# EAGLE design surficial_tilt_v2_1.2 (EAGLE 9.6.2)
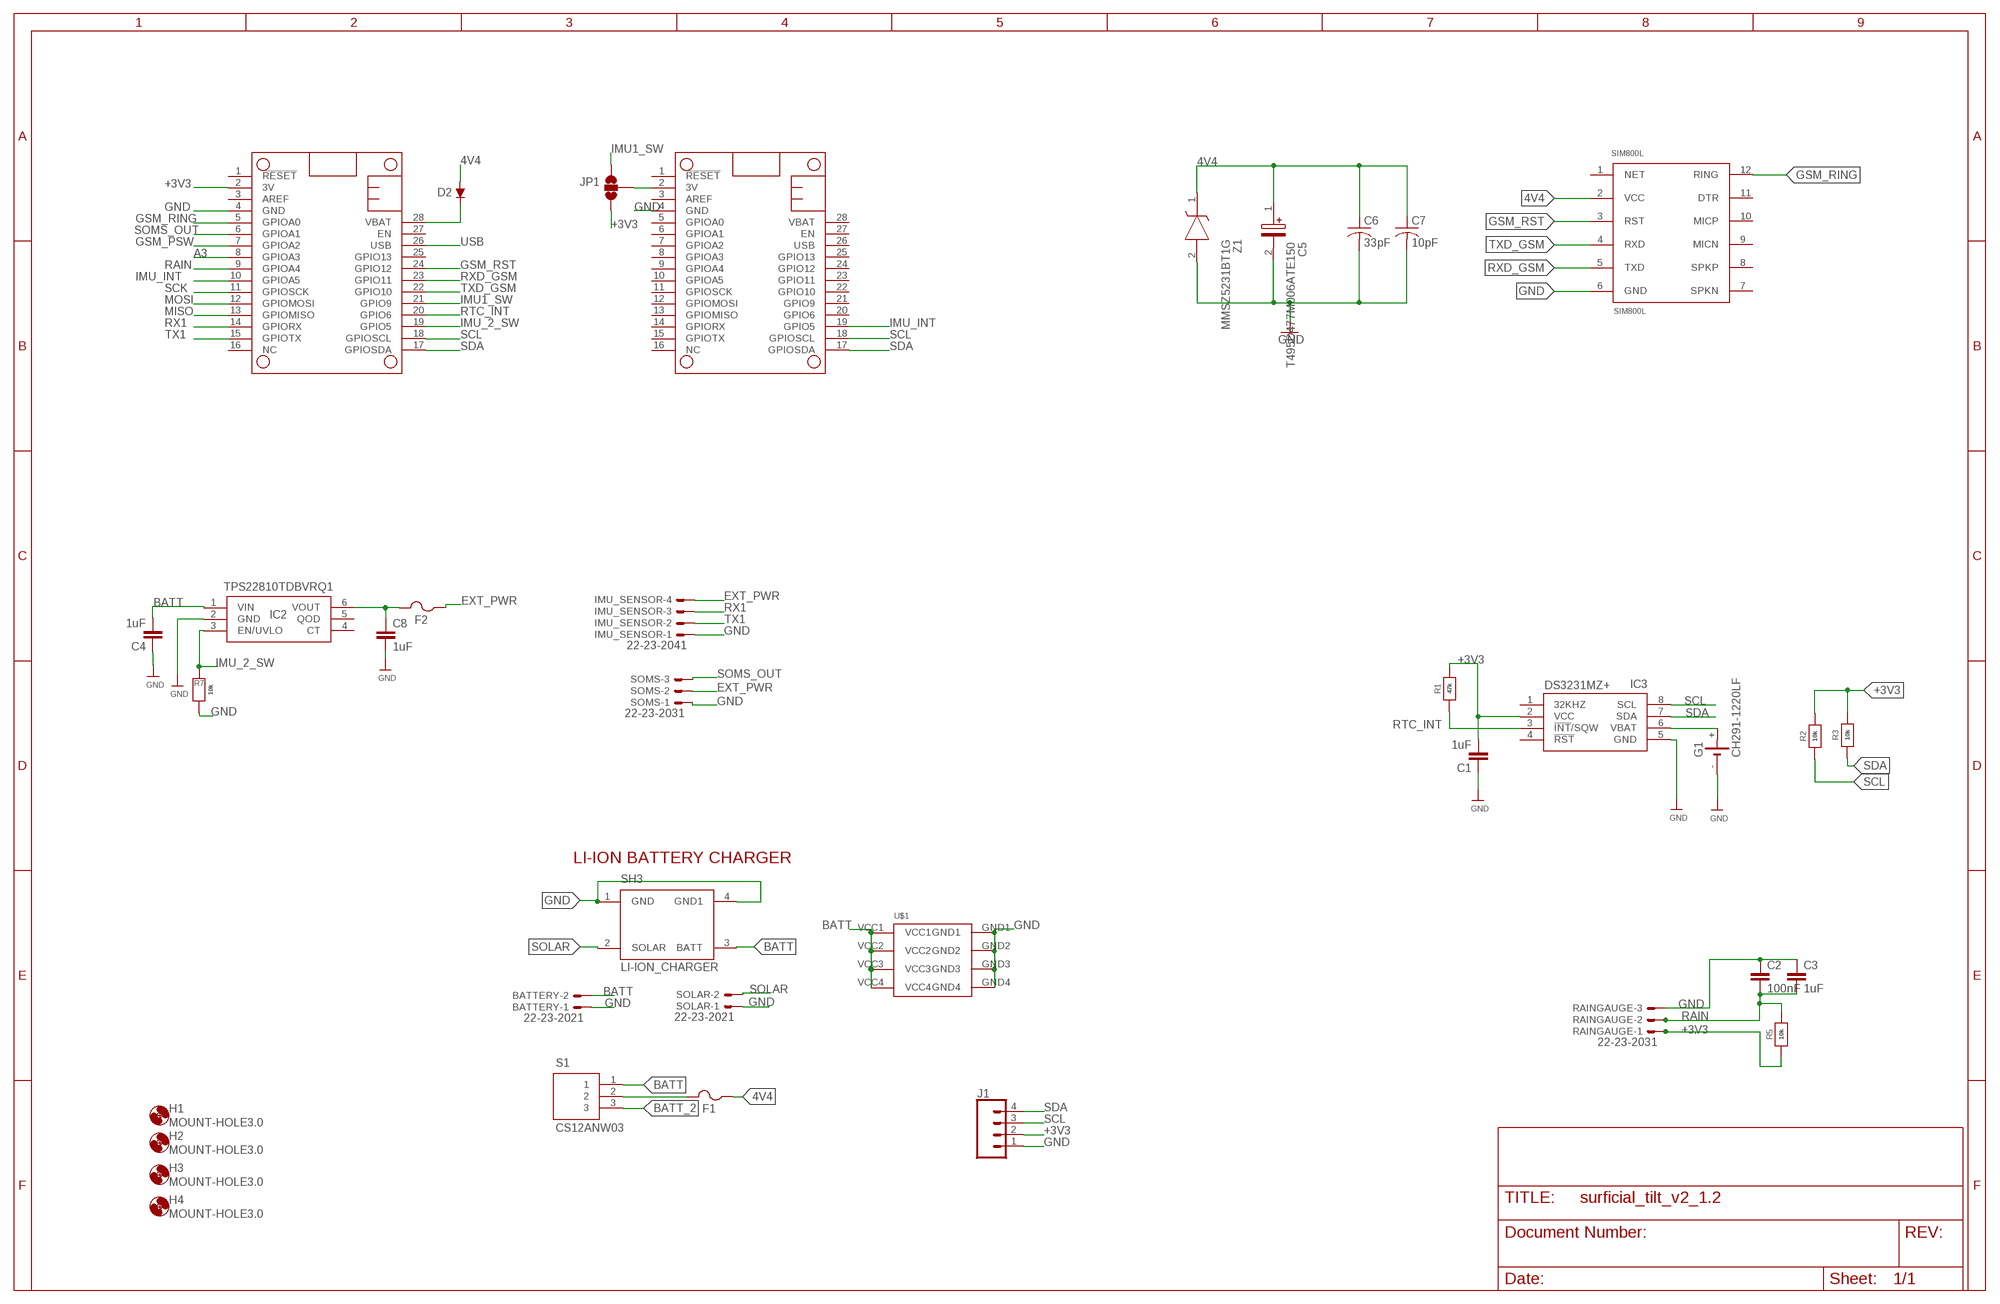
[diagram p0: schematic, sheet 1]

## Parts
BATTERY  22-23-2021  [22-23-2021]
C1  1uF  CC0603  [C0603]
C2  100nF  CC0603  [C0603]
C3  1uF  CC0603  [C0603]
C4  1uF  CC0603  [C0603]
C5  T495D477M006ATE150  [CAPPM7343X310N]
C6  33pF  C-USC0603  [C0603]
C7  10pF  C-USC0603  [C0603]
C8  1uF  CC0603  [C0603]
D2  DIODE_DIODE-SOD123  [DIODE_SOD123]
F1  PTCFUSE-1206  [R1206]
F2  PTCFUSE-1206  [R1206]
G1  CH291-1220LF  [CH291-1220LF]
H1  MOUNT-HOLE3.0  [3,0]
H2  MOUNT-HOLE3.0  [3,0]
H3  MOUNT-HOLE3.0  [3,0]
H4  MOUNT-HOLE3.0  [3,0]
IC2  TPS22810TDBVRQ1  [SOT95P280X145-6N]
IC3  DS3231MZ+  [SOIC127P600X175-8N]
IMU_SENSOR  22-23-2041  [22-23-2041]
J1  CONN_04PTH  [1X04]
JP1  JUMPER-SMT_3_NO_SILK  [SMT-JUMPER_3_NO_SILK]
MS2  FEATHERWING_NODIM  [FEATHERWING_DIM]
MS3  FEATHERWING_NODIM  [FEATHERWING_DIM]
R1  47k  RESISTOR_0603_NOOUT  [0603-NO]
R2  10k  RESISTOR_0603_NOOUT  [0603-NO]
R3  10k  RESISTOR_0603_NOOUT  [0603-NO]
R5  10k  RESISTOR_0603_NOOUT  [0603-NO]
R7  10k  RESISTOR_0603_NOOUT  [0603-NO]
RAINGAUGE  22-23-2031  [22-23-2031]
S1  CS12ANW03  [CS12ANW03]
SH3  LI-ION_CHARGER  [LI-ION_CHARGER]
SIM800L  SIM800L  [GSM_SIM800L]
SOLAR  22-23-2021  [22-23-2021]
SOMS  22-23-2031  [22-23-2031]
U$1  18650_HOLDER4_BATT_18650_BOTTOM  [4_BATT_18650_BOTTOM]
Z1  MMSZ5231BT1G  [SOD3716X135N]

## Nets
3V: JP1.2 MS3.2(3V)
4V4: C5.1(+) C6.1 C7.1 D2.A F1.1 SIM800L.2(VCC) Z1.1(K)
+3V3: C1.2 IC3.2(VCC) J1.2 JP1.1 MS2.2(3V) R1.2 R2.2 R3.2 R5.1 RAINGAUGE.1
A3: MS2.8(GPIOA3)
BATT: BATTERY.2 C4.2 IC2.1(VIN) S1.1 SH3.3(BATT) U$1.VCC1 U$1.VCC2 U$1.VCC3 U$1.VCC4
BATT_2: S1.3
EXT_PWR: F2.1 IMU_SENSOR.4 SOMS.2
GND: BATTERY.1 C1.1 C2.1 C3.1 C4.1 C5.2(-) C6.2 C7.2 C8.2 G1.- IC2.2(GND) IC3.5(GND) IMU_SENSOR.1 J1.1 MS2.4(GND) MS3.4(GND) R7.1 RAINGAUGE.3 SH3.1(GND) SH3.4(GND1) SIM800L.6(GND) SOLAR.1 SOMS.1 U$1.GND1 U$1.GND2 U$1.GND3 U$1.GND4 Z1.2(A)
GSM_PSW: MS2.7(GPIOA2)
GSM_RING: MS2.5(GPIOA0) SIM800L.12(RING)
GSM_RST: MS2.24(GPIO12) SIM800L.3(RST)
IMU1_SW: JP1.3 MS2.21(GPIO9)
IMU_2_SW: IC2.3(EN/UVLO) MS2.19(GPIO5) R7.2
IMU_INT: MS2.10(GPIOA5) MS3.19(GPIO5)
MISO: MS2.13(GPIOMISO)
MOSI: MS2.12(GPIOMOSI)
N$1: C8.1 F2.2 IC2.6(VOUT)
N$2: G1.+ IC3.6(VBAT)
N$16: F1.2 S1.2
RAIN: C2.2 C3.2 MS2.9(GPIOA4) R5.2 RAINGAUGE.2
RTC_INT: IC3.3(!INT!/SQW) MS2.20(GPIO6) R1.1
RX1: IMU_SENSOR.3 MS2.14(GPIORX)
RXD_GSM: MS2.23(GPIO11) SIM800L.5(TXD)
SCK: MS2.11(GPIOSCK)
SCL: IC3.8(SCL) J1.3 MS2.18(GPIOSCL) MS3.18(GPIOSCL) R2.1
SDA: IC3.7(SDA) J1.4 MS2.17(GPIOSDA) MS3.17(GPIOSDA) R3.1
SOLAR: SH3.2(SOLAR) SOLAR.2
SOMS_OUT: MS2.6(GPIOA1) SOMS.3
TX1: IMU_SENSOR.2 MS2.15(GPIOTX)
TXD_GSM: MS2.22(GPIO10) SIM800L.4(RXD)
USB: MS2.26(USB)
VBAT: D2.C MS2.28(VBAT)
Unconnected: IC2.4(CT) IC2.5(QOD) IC3.1(32KHZ) IC3.4(!RST) MS2.1(!RESET) MS2.3(AREF) MS2.16(NC) MS2.25(GPIO13) MS2.27(EN) MS3.1(!RESET) MS3.3(AREF) MS3.5(GPIOA0) MS3.6(GPIOA1) MS3.7(GPIOA2) MS3.8(GPIOA3) MS3.9(GPIOA4) MS3.10(GPIOA5) MS3.11(GPIOSCK) MS3.12(GPIOMOSI) MS3.13(GPIOMISO) MS3.14(GPIORX) MS3.15(GPIOTX) MS3.16(NC) MS3.20(GPIO6) MS3.21(GPIO9) MS3.22(GPIO10) MS3.23(GPIO11) MS3.24(GPIO12) MS3.25(GPIO13) MS3.26(USB) MS3.27(EN) MS3.28(VBAT) SIM800L.1(NET) SIM800L.7(SPKN) SIM800L.8(SPKP) SIM800L.9(MICN) SIM800L.10(MICP) SIM800L.11(DTR)

## Notes on the sheet
- LI-ION BATTERY CHARGER

## Library data of the parts
BATTERY SOLAR = con-molex:22-23-2021: .100" (2.54mm) Center Header - 2 Pin; MF: MOLEX; MPN: 22-23-2021; OC_FARNELL: 1462926; OC_NEWARK: 25C3832
C1-C4 C8 = eagle-ltspice:C: CAPACITOR, European symbol; SPICEMODEL: NONE; SPICEPREFIX: C
C5 = SamacSys_Parts:T495D477M006ATE150: Tantalum Capacitors - Solid SMD 6.3volts 470uF 20% Source: Datasheet <https://componentsearchengine.com/Datasheets/1/T495D477M006ATE150.pdf>; DESCRIPTION: Tantalum Capacitors - Solid SMD 6.3volts 470uF 20%; HEIGHT: 3.1mm; MANUFACTURER_NAME: Kemet; MANUFACTURER_PART_NUMBER: T495D477M006ATE150; MOUSER_PART_NUMBER: 80-T495D477M6ATE150; MOUSER_PRICE-STOCK: https://www.mouser.com/Search/Refine.aspx?Keyword=80-T495D477M6ATE150
C6 C7 = rcl:C-US: CAPACITOR, American symbol; SPICEPREFIX: C
D2 = 52101-101-REV-A_v16:DIODE_DIODE-: DIODE
F1 F2 = adafruit:PTCFUSE: PTC fuses, resettable thermistors
G1 = battery:CH291-1220LF: Battery Holder, SMT, 12mm multicomp PART NO. CH291-1220LF Source: Data sheet <http://www.farnell.com/datasheets/1505860.pdf>
H1-H4 = holes:MOUNT-HOLE: MOUNTING HOLE with drill center marker
IC2 = TPS22810TDBVRQ1:TPS22810TDBVRQ1: Automotive 18V, 2A, 79m Load Switch With Adjustable Rise Time and Adjustable Quick Output Discharge Source: Datasheet <http://www.ti.com/lit/gpn/tps22810-q1>; DESCRIPTION: Automotive 18V, 2A, 79m Load Switch With Adjustable Rise Time and Adjustable Quick Output Discharge; HEIGHT: 1.45mm; MANUFACTURER_NAME: Texas Instruments; MANUFACTURER_PART_NUMBER: TPS22810TDBVRQ1
IC3 = DS3231MZ+:DS3231MZ+: Real Time Clock 5+/-ppm RTC Source: Datasheet <http://uk.rs-online.com/web/p/products/1897249>; DESCRIPTION: Real Time Clock 5+/-ppm RTC; HEIGHT: 1.75mm; MANUFACTURER_NAME: Maxim Integrated; MANUFACTURER_PART_NUMBER: DS3231MZ+; RS_PART_NUMBER: 1897249; RS_PRICE-STOCK: http://uk.rs-online.com/web/p/products/1897249
IMU_SENSOR = con-molex:22-23-2041: .100" (2.54mm) Center Header - 4 Pin; MF: MOLEX; MPN: 22-23-2041; OC_FARNELL: 1462920; OC_NEWARK: 38C0355
J1 = SparkFun-Connectors:CONN_04: Multi connection point. Often used as Generic Header-pin footprint for 0.1 inch spaced/style header connections On any of the 0.1 inch spaced packages, you can populate with these: Break Away Headers - Straight <https://www.sparkfun.com/products/116> (PRT-00116) Break Away Male Headers - Right Angle <https://www.sparkfun.com/products/553> (PRT-00553) Female Headers <https://www.sparkfun.com/products/115> (PRT-00115) Break Away Headers - Machine Pin <https://www.sparkfun.com/products/117> (PRT-00117) Break Away Female Headers - Swiss Machine Pin <https://www.sparkfun.com/products/743> (PRT-00743) For SCREWTERMINALS and SPRING TERMINALS visit here: Screw Terimnals on SparkFun.com <https://www.sparkfun.com/search/results?term=Screw+Terminals> (5mm/3.5mm/2.54mm spacing) This device is also useful as a general connection point to wire up your design to another part of your project. Our various solder wires solder well into these plated through hole pads. Hook-Up Wire - Assortment (Stranded, 22 AWG) <https://www.sparkfun.com/products/11375> (PRT-11375) Hook-Up Wire - Assortment (Solid Core, 22 AWG) <https://www.sparkfun.com/products/11367> (PRT-11367) View the entire wire category on our website here <https://www.sparkfun.com/categories/141> Special notes: Molex polarized connector foot print use with SKU : PRT-08231 with associated crimp pins and housings. 1MM SMD Version SKU: PRT-10208; PROD_ID: CONN-09696
JP1 = SparkFun-Jumpers:JUMPER-SMT_3_NO: Normally open jumper This jumper has three pads in close proximity to each other. Apply solder to close the connection(s).
MS2 MS3 = adafruit:FEATHERWING
R1-R3 R5 R7 = microbuilder:RESISTOR: Resistors For new designs, use the packages preceded by an '_' character since they are more reliable: The following footprints should be used on most boards: _0402 - Standard footprint for regular board layouts _0603 - Standard footprint for regular board layouts _0805 - Standard footprint for regular board layouts _1206 - Standard footprint for regular board layouts For extremely tight-pitch boards where space is at a premium, the following 'micro-pitch' footprints can be used (smaller pads, no silkscreen outline, etc.): _0402MP - Micro-pitch footprint for very dense/compact boards _0603MP - Micro-pitch footprint for very dense/compact boards _0805MP - Micro-pitch footprint for very dense/compact boards _1206MP - Micro-pitch footprint for very dense/compact boards
RAINGAUGE SOMS = con-molex:22-23-2031: .100" (2.54mm) Center Header - 3 Pin; MF: MOLEX; MPN: 22-23-2031; OC_FARNELL: 1462950; OC_NEWARK: 30C0862
S1 = SamacSys_Parts:CS12ANW03: NKK SWITCHES - CS12ANW03 - SWITCH, SLIDE, SPDT, 3A, 250V, TH Source: Datasheet <http://www.nkkswitches.com/pdf/cs.pdf>; ARROW_PART_NUMBER: CS12ANW03; ARROW_PRICE-STOCK: https://www.arrow.com/en/products/cs12anw03/nkk-switches; DESCRIPTION: NKK SWITCHES - CS12ANW03 - SWITCH, SLIDE, SPDT, 3A, 250V, TH; HEIGHT: mm; MANUFACTURER_NAME: NKK Switches; MANUFACTURER_PART_NUMBER: CS12ANW03; MOUSER_PART_NUMBER: 633-CS12ANW03; MOUSER_PRICE-STOCK: https://www.mouser.co.uk/ProductDetail/NKK-Switches/CS12ANW03?qs=4P1McwaGddbVHu%252BBZT0egw%3D%3D
SH3 = Li-Ion_chargers:LI-ION_CHARGER
SIM800L = gsm_shield:SIM800L
U$1 = 18650_holder_4:18650_HOLDER
Z1 = SamacSys_Parts:MMSZ5231BT1G: 5.1V Zener diode,MMSZ5231B 500mW ON Semiconductor MMSZ5231BT1G Zener Diode, 5.1V 5% 0.5 W SMT 2-Pin SOD-123 Source: Datasheet <http://uk.rs-online.com/web/p/products/5453049P>; ALLIED_NUMBER: 70099546; DESCRIPTION: 5.1V Zener diode,MMSZ5231B 500mW ON Semiconductor MMSZ5231BT1G Zener Diode, 5.1V 5% 0.5 W SMT 2-Pin SOD-123; HEIGHT: 1.35mm; MANUFACTURER_NAME: ON Semiconductor; MANUFACTURER_PART_NUMBER: MMSZ5231BT1G; RS_PART_NUMBER: 5453049P

## Board
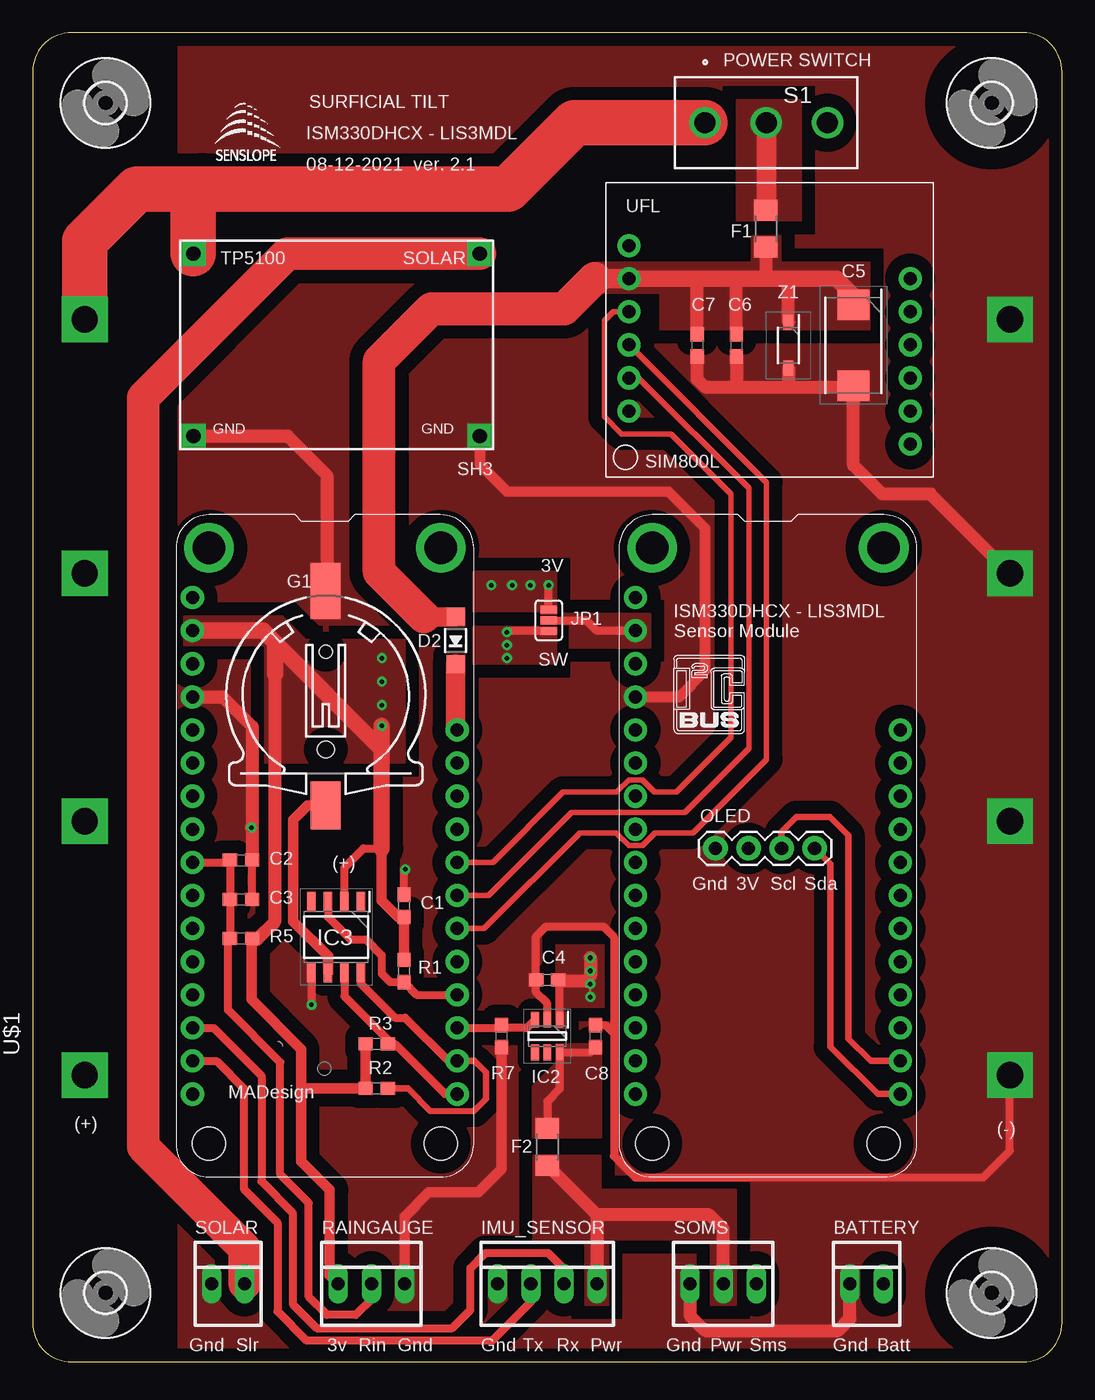
[diagram p1: board, top side]
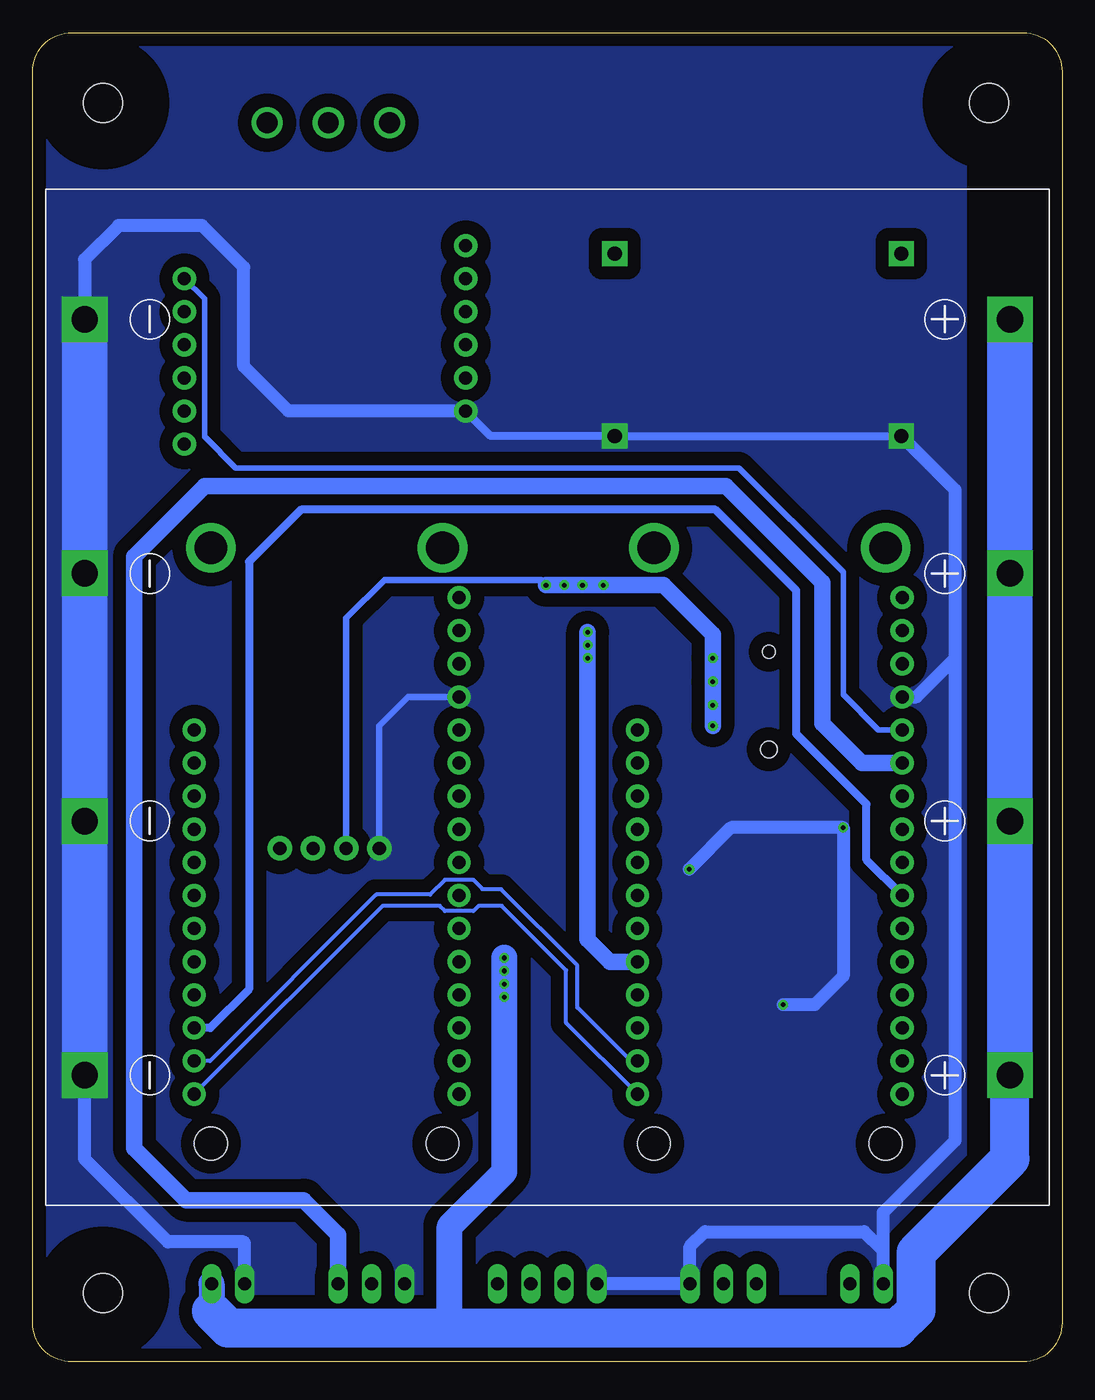
[diagram p2: board, bottom side, seen from below]

Size 79 x 102 mm. Coordinates in mm from the lower left corner, seen from the top.
Outline: 76,102 3,102 arc90 0,99 0,3 arc90 3,0 76,0 arc90 79,3 79,99 arc90 76,102
Copper layers (1*16): Top 0.035mm / dielectric 1.5mm / Bottom 0.035mm
Design rules "default": minimum track width 6mil, minimum drill 0.35mm, track to track 6mil, track to pad 6mil, pad to pad 6mil, via to via 6mil, smd to smd 6mil, copper to edge 40mil, drill to drill 6mil, minimum pad ring 10mil, minimum via ring 8mil, stop-mask expansion 4mil, vias tented up to drill 0mil, thermal gap 10mil

### Footprints (pad centres in the part's own frame; a part is rotated, then mirrored left to right if it is on the bottom)
22-23-2021 = drill 1 long: 1 -1.27,0; 2 1.27,0
C0603 = smd 1.1 x 1: 1 -0.85,0; 2 0.85,0
CAPPM7343X310N = smd 2.35 x 2.45: 1 -3.1,0; 2 3.1,0
DIODE_SOD123 = smd 1.4 x 1.4: A 1.805,0; C -1.805,0
R1206 = smd 1.6 x 1.803: 1 -1.422,0; 2 1.422,0
CH291-1220LF = smd 2.3 x 3.66: + 0,-2.296 | smd 2.3 x 4.3: - 0,14.146 | hole 1.3: 0,2 | hole 1: 0,9.5
3,0 = hole 3: 0,0
SOT95P280X145-6N = smd 1.2 x 0.6: 1 -1.25,0.95; 2 -1.25,0; 3 -1.25,-0.95; 4 1.25,-0.95; 5 1.25,0; 6 1.25,0.95
SOIC127P600X175-8N = smd 1.525 x 0.65: 1 -2.712,1.905; 2 -2.712,0.635; 3 -2.712,-0.635; 4 -2.712,-1.905; 5 2.712,-1.905; 6 2.712,-0.635; 7 2.712,0.635; 8 2.712,1.905
22-23-2041 = drill 1 long: 1 -3.81,0; 2 -1.27,0; 3 1.27,0; 4 3.81,0
1X04 = drill 1.016 pad 1.88: 1 0,0; 2 2.54,0; 3 5.08,0; 4 7.62,0
SMT-JUMPER_3_NO_SILK = smd 0.635 x 1.27: 1 -0.813,0; 2 0,0; 3 0.813,0
FEATHERWING_DIM = drill 1 pad 1.778: 1 6.35,1.27; 2 8.89,1.27; 3 11.43,1.27; 4 13.97,1.27; 5 16.51,1.27; 6 19.05,1.27; 7 21.59,1.27; 8 24.13,1.27; 9 26.67,1.27; 10 29.21,1.27; 11 31.75,1.27; 12 34.29,1.27; 13 36.83,1.27; 14 39.37,1.27; 15 41.91,1.27; 16 44.45,1.27; 17 44.45,21.59; 18 41.91,21.59; 19 39.37,21.59; 20 36.83,21.59; 21 34.29,21.59; 22 31.75,21.59; 23 29.21,21.59; 24 26.67,21.59; 25 24.13,21.59; 26 21.59,21.59; 27 19.05,21.59; 28 16.51,21.59 | drill 2.5 pad 3.81: P$1 2.54,20.32; P$2 2.54,2.54 | hole 2.54: 48.26,20.32; 48.26,2.54
0603-NO = smd 1.1 x 1: 1 -0.85,0; 2 0.85,0
22-23-2031 = drill 1 long: 1 -2.54,0; 2 0,0; 3 2.54,0
CS12ANW03 = drill 1.6 pad 2.37: 1 0,-4.7; 2 0,0; 3 0,4.7
LI-ION_CHARGER = drill 1.1 pad 1.93 square: 1 0,0; 2 0,-14; 3 22,-14; 4 22,0
GSM_SIM800L = drill 1 pad 1.778: 1 0,0; 2 0,-2.54; 3 0,-5.08; 4 0,-7.62; 5 0,-10.16; 6 0,-12.7; 7 21.59,-15.24; 8 21.59,-12.7; 9 21.59,-10.16; 10 21.59,-7.62; 11 21.59,-5.08; 12 21.59,-2.54
4_BATT_18650_BOTTOM = drill 2.03 pad 3.5 square: GND1 10,3; GND2 29.5,3; GND3 48.5,3; GND4 68,3; VCC1 10,74; VCC2 29.5,74; VCC3 48.5,74; VCC4 68,74
SOD3716X135N = smd 1.15 x 0.8: 1 -1.75,0; 2 1.75,0

### Placement (x,y rotation side)
BATTERY  64,6 0 top
C1  28.5,35 270 top
C2  16,38.5 180 top
C3  16,35.5 180 top
C4  39.5,29.31 0 top
C5  63,78 270 top
C6  54,78 270 top
C7  51,78 270 top
C8  43.19,25 90 top
D2  32.47,55.36 90 top
F1  56.27,86.96 90 top
F2  39.5,16.5 90 top
G1  22.5,45 0 top
H1  5.6,5.3 0 top
H2  73.6,96.6 0 top
H3  5.6,96.6 0 top
H4  73.6,5.3 0 top
IC2  39.5,25 270 top
IC3  23.3,32.6 270 top
IMU_SENSOR  39.5,6 0 top
J1  52.4,39.4 0 top
JP1  39.6,56.9 270 top
MS2  11,65 270 top
MS3  45,65 270 top
R1  28.5,30 90 top
R2  26.4,21 180 top
R3  26.4,24.4 180 top
R5  16,32.5 180 top
R7  36,25 90 top
RAINGAUGE  26,6 0 top
S1  56.3,95.08 270 top
SH3  34.33,71.04 180 top
SIM800L  45.76,85.66 0 top
SOLAR  15,6 0 top
SOMS  53,6 0 top
U$1  78,12 90 top
U$2  [LOGO]  15,22 0 top
U$3  [I2C]  49.2,48.2 0 top
U$13  [LOGO_SML_TNAME]  16.27,93.8 0 top
Z1  58,78 270 top

### Tracks (layer width: path | path; a pad name or v marks a point on that pad's centre or on a via)
3V
  Top 0.61: JP1.2 42.5,56.9 43.29,56.11 MS3.2
  pour Top (no thermals): 40.8,56.6 41.2,56.6 41.2,54.8 47.4,54.8 47.4,57.4 40.8,57.4
4V4
  Top 1.016: C7.1 51,83.12 | C6.1 54,83.12 | Z1.1 58,83.12 | F1.1 56.27,83.19 56.2,83.12
  Top 1.27: SIM800L.2 51,83.12 54,83.12 56.2,83.12 58,83.12 61.68,83.12 63.2,81.6 63.2,81.3 C5.1
  Top 1.5: D2.A 30.04,57.16 | 43.12,83.12 SIM800L.2
  Top 2.54: 30.04,57.16 26.6,60.6 26.6,76.8 30.6,80.8 40.8,80.8 43.12,83.12
  pour Top (no thermals): 43.4,84.4 55.2,84.4 55.2,86.4 57.4,86.4 57.4,84.4 64.2,84.4 64.2,79.2 48.2,79.2 48.2,82 43.4,82
+3V3  (via drill 0.35)
  Top 0.61: 16.8,32.45 R5.1 | IC3.2 23.93,37.94 25.4,39.4 26.8,39.4 | JP1.1 v39.6,59.6
  Top 0.813: RAINGAUGE.1 22.8,6.66 22.8,13.2 20.6,15.4 20.6,21 | 16.8,32.45 16.8,27.8 20.6,24 20.6,21 | R3.2 R2.2 20.6,21 | R1.2 C1.2 28.05,34.15 26.8,35.4 26.8,39.4
  Top 1.016: R5.1 16.95,32.4 17.2,32.4 18.6,33.8 18.6,52.8
  Top 1.27: MS2.2 17.69,56.11 18.6,55.2 | 18.6,55.2 26.8,47 | 26.8,39.4 26.8,47 | 18.6,52.8 18.6,55.2 | 26.8,47 v26.8,48.8
  Bottom 0.508: J1.2 54.94,57.06 52,60 40,60 v39.6,59.6 v38.2,59.6 | v35.2,59.6 v36.8,59.6 | v26.8,50.4 v26.8,48.8
  Bottom 1.27: v26.8,48.8 v26.8,52.2 v26.8,54 26.8,55.8 30.6,59.6 v36.8,59.6 v39.6,59.6
  pour Top (no thermals): 40.2,57.6 40.2,60.6 33.8,60.6 33.8,57.6
  pour Top (no thermals): 11.6,55 17.8,55 17.8,46 28.6,46 28.6,55.4 21,55.4 19.2,57.2 11.6,57.2
BATT  (via drill 0.35)
  Top 0.152: v42.8,28 v42.8,29 42.8,29.6 v42.8,30
  Top 0.61: IC2.1 40.45,29.21 C4.2
  Top 1.016: v42.8,31 42.8,29.6 42.4,29.2 40.46,29.2 C4.2
  Top 3.5: U$1.VCC4 4,86 8,90 13,90 | S1.1 41.58,95.08 36.5,90 13,90 | SH3.3 12.33,89.33 13,90
  Bottom 2: BATTERY.2 65.27,3.89 | 47,2.62 47,10.4 42.8,14.6 v42.8,31
  Bottom 3: 65.27,3.89 64,2.62 47,2.62 12.58,2.62 11.2,4 11.2,8.4 4,15.6 U$1.VCC1
  Bottom 3.5: U$1.VCC1 U$1.VCC2 U$1.VCC3 U$1.VCC4
  pour Top (no thermals): 40.2,25.6 40.2,32 43.8,32 43.8,27.2 40.8,27.2 40.8,25.6
EXT_PWR
  Top 1.016: F2.1 43.31,11.27 | 43.31,11.27 IMU_SENSOR.4 | SOMS.2 53,10.2 51.93,11.27 43.31,11.27
  pour Top (no thermals): 38.4,15.8 38.4,9.4 42.4,9.4 42.4,4.4 44.2,4.4 44.2,9.4 52,9.4 52,4.4 54,4.4 54,13.2 43.6,13.2 43.6,15.8
GND  (via drill 0.35)
  Top 0.61: IC2.2 39.5,27.5 38.65,28.35 C4.1 38.65,32.65 39.4,33.4 43.8,33.4 44.6,32.6 44.6,25.2 | C3.1 C2.1 | IC3.5 v21.39,27.41 v21.4,27.4 | C1.1 28.5,37.7 v28.6,37.8 | C8.2 43.95,25.85 44.6,25.2 | U$1.GND1 75,16.2 72.95,14.15 46.25,14.15 44.6,15.8 44.6,25.2
  Top 0.813: MS3.4 49.63,51.03 51.6,53 51.6,64 48.8,66.8 36.4,66.8 34.33,68.87 SH3.1 | RAINGAUGE.3 28.54,11.14 30.4,13 34.2,13 36,14.8 R7.1
  Top 1.016: SH3.4 19.56,71.04 22.6,68 22.6,58.6 22.5,58.7 G1.- | MS2.4 14.57,51.03 16.85,48.75 16.85,40.95 | v16.8,41 16.85,40.95 | 16.85,40.95 C2.1 | SOMS.1 50.46,3.54 51.6,2.4 61.8,2.4 62.73,3.33 BATTERY.1 | U$1.GND3 68.9,66.6 65.2,66.6 63,68.8 C5.2 62.9,74.8 58,74.8 | C7.2 51,75.4 51.6,74.8 54,74.8 | 54,74.8 58,74.8 | C6.2 54,74.8 | Z1.2 58,74.8
  Bottom 0.508: J1.1 52.4,48.8 50.17,51.03 MS3.4
  Bottom 0.61: SIM800L.6 43.84,71.04 SH3.1 SH3.4
  Bottom 1.016: MS2.4 11.17,51.03 8.2,54 | 8.2,54 8.2,66.91 SH3.4 | v28.6,37.8 25.4,41 v16.8,41 16.8,29.6 19,27.4 v21.4,27.4 | SOLAR.1 13.73,8.53 | IMU_SENSOR.1 RAINGAUGE.3 28.54,8.86 27.4,10 15.2,10 13.73,8.53 | U$1.GND1 75,15.6 68.6,9.2 62.8,9.2 62.73,9.13 BATTERY.1 | 13.73,8.53 13.73,11.47 8.2,17 8.2,54 | SIM800L.6 59.36,72.96 62.8,76.4 62.8,84 66,87.2 72.4,87.2 75,84.6 U$1.GND4
  Bottom 3.5: U$1.GND1 U$1.GND2 U$1.GND3 U$1.GND4
  pour Bottom (isolate 1.016, no thermals): 7.4,0 76,0 arc90 79,3 79,99 arc90 76,102 7.4,102
  pour Top (isolate 1.016, rank 2, no thermals): 11.2,102 76,102 arc-90 79,99 79,3 arc-90 76,0 11.2,0
GSM_RING
  Bottom 0.406: MS2.5 14.09,48.49 16.8,51.2 16.8,60.6 24.8,68.6 63.4,68.6 65.8,71 65.8,81.57 SIM800L.12
GSM_RST
  Top 0.406: MS2.24 35.33,38.33 40.72,43.72 44.82,43.72 45.75,44.66 46.79,44.66 47.72,43.72 49.4,43.72 53.6,47.92 53.6,66.6 49,71.2 45.2,71.2 43.88,72.52 43.88,79.89 44.57,80.58 SIM800L.3
IMU1_SW  (via drill 0.35)
  Top 0.61: JP1.3 36.49,56.09 v36.4,56
  Bottom 1.27: MS2.21 34.71,30.71 36.4,32.4 v36.4,56
  other vias: 36.4,55 36.4,54
  pour Top (no thermals): 40.2,56.4 33.8,56.4 33.8,53.6 40.2,53.6
IMU_2_SW
  Top 0.61: MS2.19 35.78,25.63 | 35.78,25.63 R7.2 | IC2.3 37.93,25.63 35.78,25.63
IMU_INT
  Bottom 0.61: MS2.10 15,38.52 15,42.8 20.4,48.2 20.4,59.2 26.6,65.4 58.4,65.4 62.4,61.4 62.4,28.6 65.37,25.63 MS3.19
N$1
  Top 0.61: F2.2 39.5,20 40.45,20.95 IC2.6 42.79,23.75 C8.1
  pour Top (no thermals): 40.2,24.4 43.6,24.4 43.6,17.2 38.4,17.2 38.4,21.2 40.2,23
N$2
  Top 0.813: IC3.6 22.66,31.14 20,33.8 20,41.6 21.11,42.7 G1.+
N$16
  Top 1.5: S1.2 56.3,88.41 F1.2
  pour Top (no thermals): 54,87.6 59,87.6 59,96.8 54,96.8
RAIN
  Top 0.61: MS2.9 14.98,38.33 C2.2 C3.2 R5.2 15,32.35 15,27 19,23 19,14.4 21.2,12.2 21.2,5 22.6,3.6 24.8,3.6 26,4.8 RAINGAUGE.2
RTC_INT
  Top 0.61: IC3.3 22.66,34.13 24.4,32.4 25.6,32.4 26.8,31.2 26.8,29.8 27.45,29.15 R1.1 29.48,28.17 MS2.20
RX1
  Top 0.61: MS2.14 13.9,25.63 17.56,21.96 17.56,13.84 19.96,11.44 19.96,4.44 21.8,2.6 32.2,2.6 33.6,4 33.6,7.2 34.77,8.37 39.56,8.37 40.77,7.15 IMU_SENSOR.3
RXD_GSM
  Top 0.406: MS2.23 34.99,35.79 41.36,42.16 50.05,42.16 54.96,47.07 54.96,67.04 46.5,75.5 SIM800L.5
SCL
  Top 0.45: 30.52,19.28 33.88,19.28
  Top 0.508: R2.1 28.8,21 30.52,19.28 | 33.88,19.28 34.8,20.2 34.8,22.2 33.91,23.09 MS2.18 | J1.3 57.48,40.68 58.6,41.8 61.2,41.8 62.6,40.4 62.6,24.8 64.31,23.09 MS3.18
  Top 0.61: IC3.8 25.2,29 27.8,26.4 28.6,26.4 31.91,23.09 MS2.18
  Bottom 0.305: MS2.18 33.09,23.09 37.2,27.2 37.2,30.41 43.05,36.26 44.48,36.26 44.48,36.28 45.18,36.98 47.36,36.98 48.49,35.86 52.62,35.86 65.39,23.09 MS3.18
SDA
  Top 0.508: J1.4 61.22,38.2 61.22,24.18 64.85,20.55 MS3.17
  Top 0.61: MS2.17 31.65,20.55 27.8,24.4 R3.1 27.25,24.75 23.93,28.07 IC3.7
  Bottom 0.305: MS2.17 38.06,26.02 38.06,30.06 43,35 44.77,35 45.18,34.6 47.36,34.6 47.77,35 52.14,35 MS3.17
SOLAR
  Top 2.5: SOLAR.2 16.27,8.73 8.5,16.5 8.5,74 19.54,85.04 SH3.2
SOMS_OUT
  Bottom 1.27: MS2.6 15.35,45.95 18.4,49 18.4,59.8 25.8,67.2 65.8,67.2 71.2,61.8 71.2,16.4 67.2,12.4 58.2,12.4 55.54,9.74 SOMS.3
TX1
  Top 0.61: MS2.15 14.11,23.09 16.2,21 16.2,13.27 18.8,10.67 18.8,3.87 21.04,1.64 35.27,1.64 38.23,4.59 IMU_SENSOR.2
TXD_GSM
  Top 0.406: MS2.22 34.66,33.25 42.01,40.6 44.78,40.6 45.75,39.62 46.79,39.62 47.76,40.6 50.69,40.6 56.32,46.23 56.32,67.48 SIM800L.4
VBAT
  Top 1.5: D2.C 32.47,48.61 MS2.28

### Text on the board
tNames: POWER SWITCH | SURFICIAL TILT | ISM330DHCX - LIS3MDL | 08-12-2021 ver. 2.1 | TP5100 | SOLAR | 3V | ISM330DHCX - LIS3MDL / Sensor Module | SW | OLED | (+) | Gnd | 3V | Scl | Sda | MADesign | (+) | (-) | Gnd | Slr | 3v | Rin | Gnd | Gnd | Tx | Rx | Pwr | Gnd | Pwr | Sms | Gnd | Batt